# Altium project SATA.PrjPcb
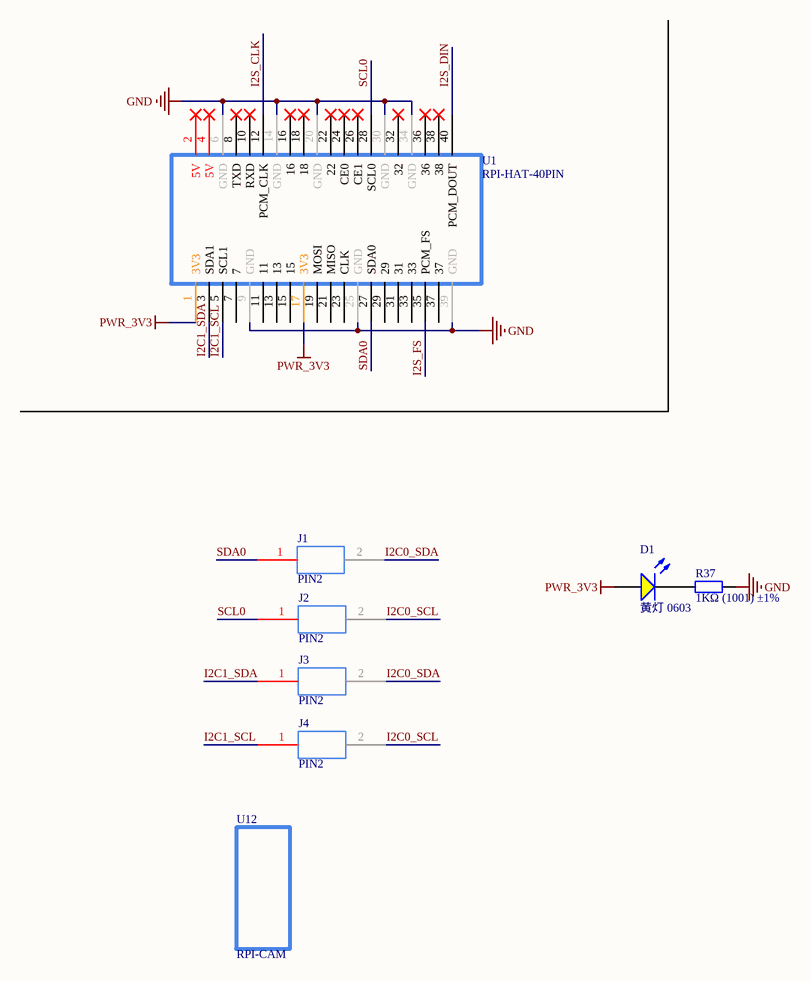
[diagram p0: S1_Interface.SchDoc]
2 sheets, 77 parts. Net scope: global (net labels, ports and power ports of the same name join across sheets).
Board file: S1.PcbDoc
Sheets:
  S1_Interface.SchDoc
  S2_Sensors.SchDoc

## Sheet S1_Interface.SchDoc
size A3; SheetNumber: 1; SheetTotal: 2

### Parts
D1  黄灯 0603  [0603_LED_S1]
J1  PIN2  [PIN2]
J2  PIN2  [PIN2]
J3  PIN2  [PIN2]
J4  PIN2  [PIN2]
R37  1KΩ (1001) ±1%  [0603_R]
U1  RPI-HAT-40PIN  [RPI-HAT-40PIN]
U12  RPI-CAM  [RPI-CAM]

### Nets
GND: R37.2 U1.6(GND) U1.9(GND) U1.14(GND) U1.20(GND) U1.25(GND) U1.30(GND) U1.34(GND) U1.39(GND)
PWR_3V3: D1.A U1.1(3V3) U1.17(3V3)
I2C0_SCL: J2.2(GND) J4.2(GND)
I2C0_SDA: J1.2(GND) J3.2(GND)
I2C1_SCL: J4.1(VCC) U1.5(SCL1)
I2C1_SDA: J3.1(VCC) U1.3(SDA1)
I2S_CLK: U1.12(PCM_CLK)
I2S_DIN: U1.40(PCM_DOUT)
I2S_FS: U1.35(PCM_FS)
SCL0: J2.1(VCC) U1.28(SCL0)
SDA0: J1.1(VCC) U1.27(SDA0)
NetD1_K: D1.K R37.1

Not connected (* = marked no-connect by the designer): U1 2(5V)* 4(5V)* 7 8(TXD)* 10(RXD)* 11 13 15 16* 18* 19(MOSI) 21(MISO) 22* 23(CLK) 24(CE0)* 26(CE1)* 29 31 32* 33 36* 37 38*

### Library data of the parts
D1 = 0603 黄灯: 发光二极管; ComponentLink1Description: 供应商链接; ComponentLink1URL: http://www.szlcsc.com/product/details_73147.html; Package: 0603; Supplier: LC; SuppliersPartNumber: C72038
R37 = 0603 1KΩ (1001) 1%: 贴片电阻; ComponentLink1Description: 供应商链接; ComponentLink1URL: http://www.szlcsc.com/product/details_21904.html; Package: 0603; Supplier: LC; SuppliersPartNumber: C21190

## Sheet S2_Sensors.SchDoc
size A3; SheetNumber: 2; SheetTotal: 2
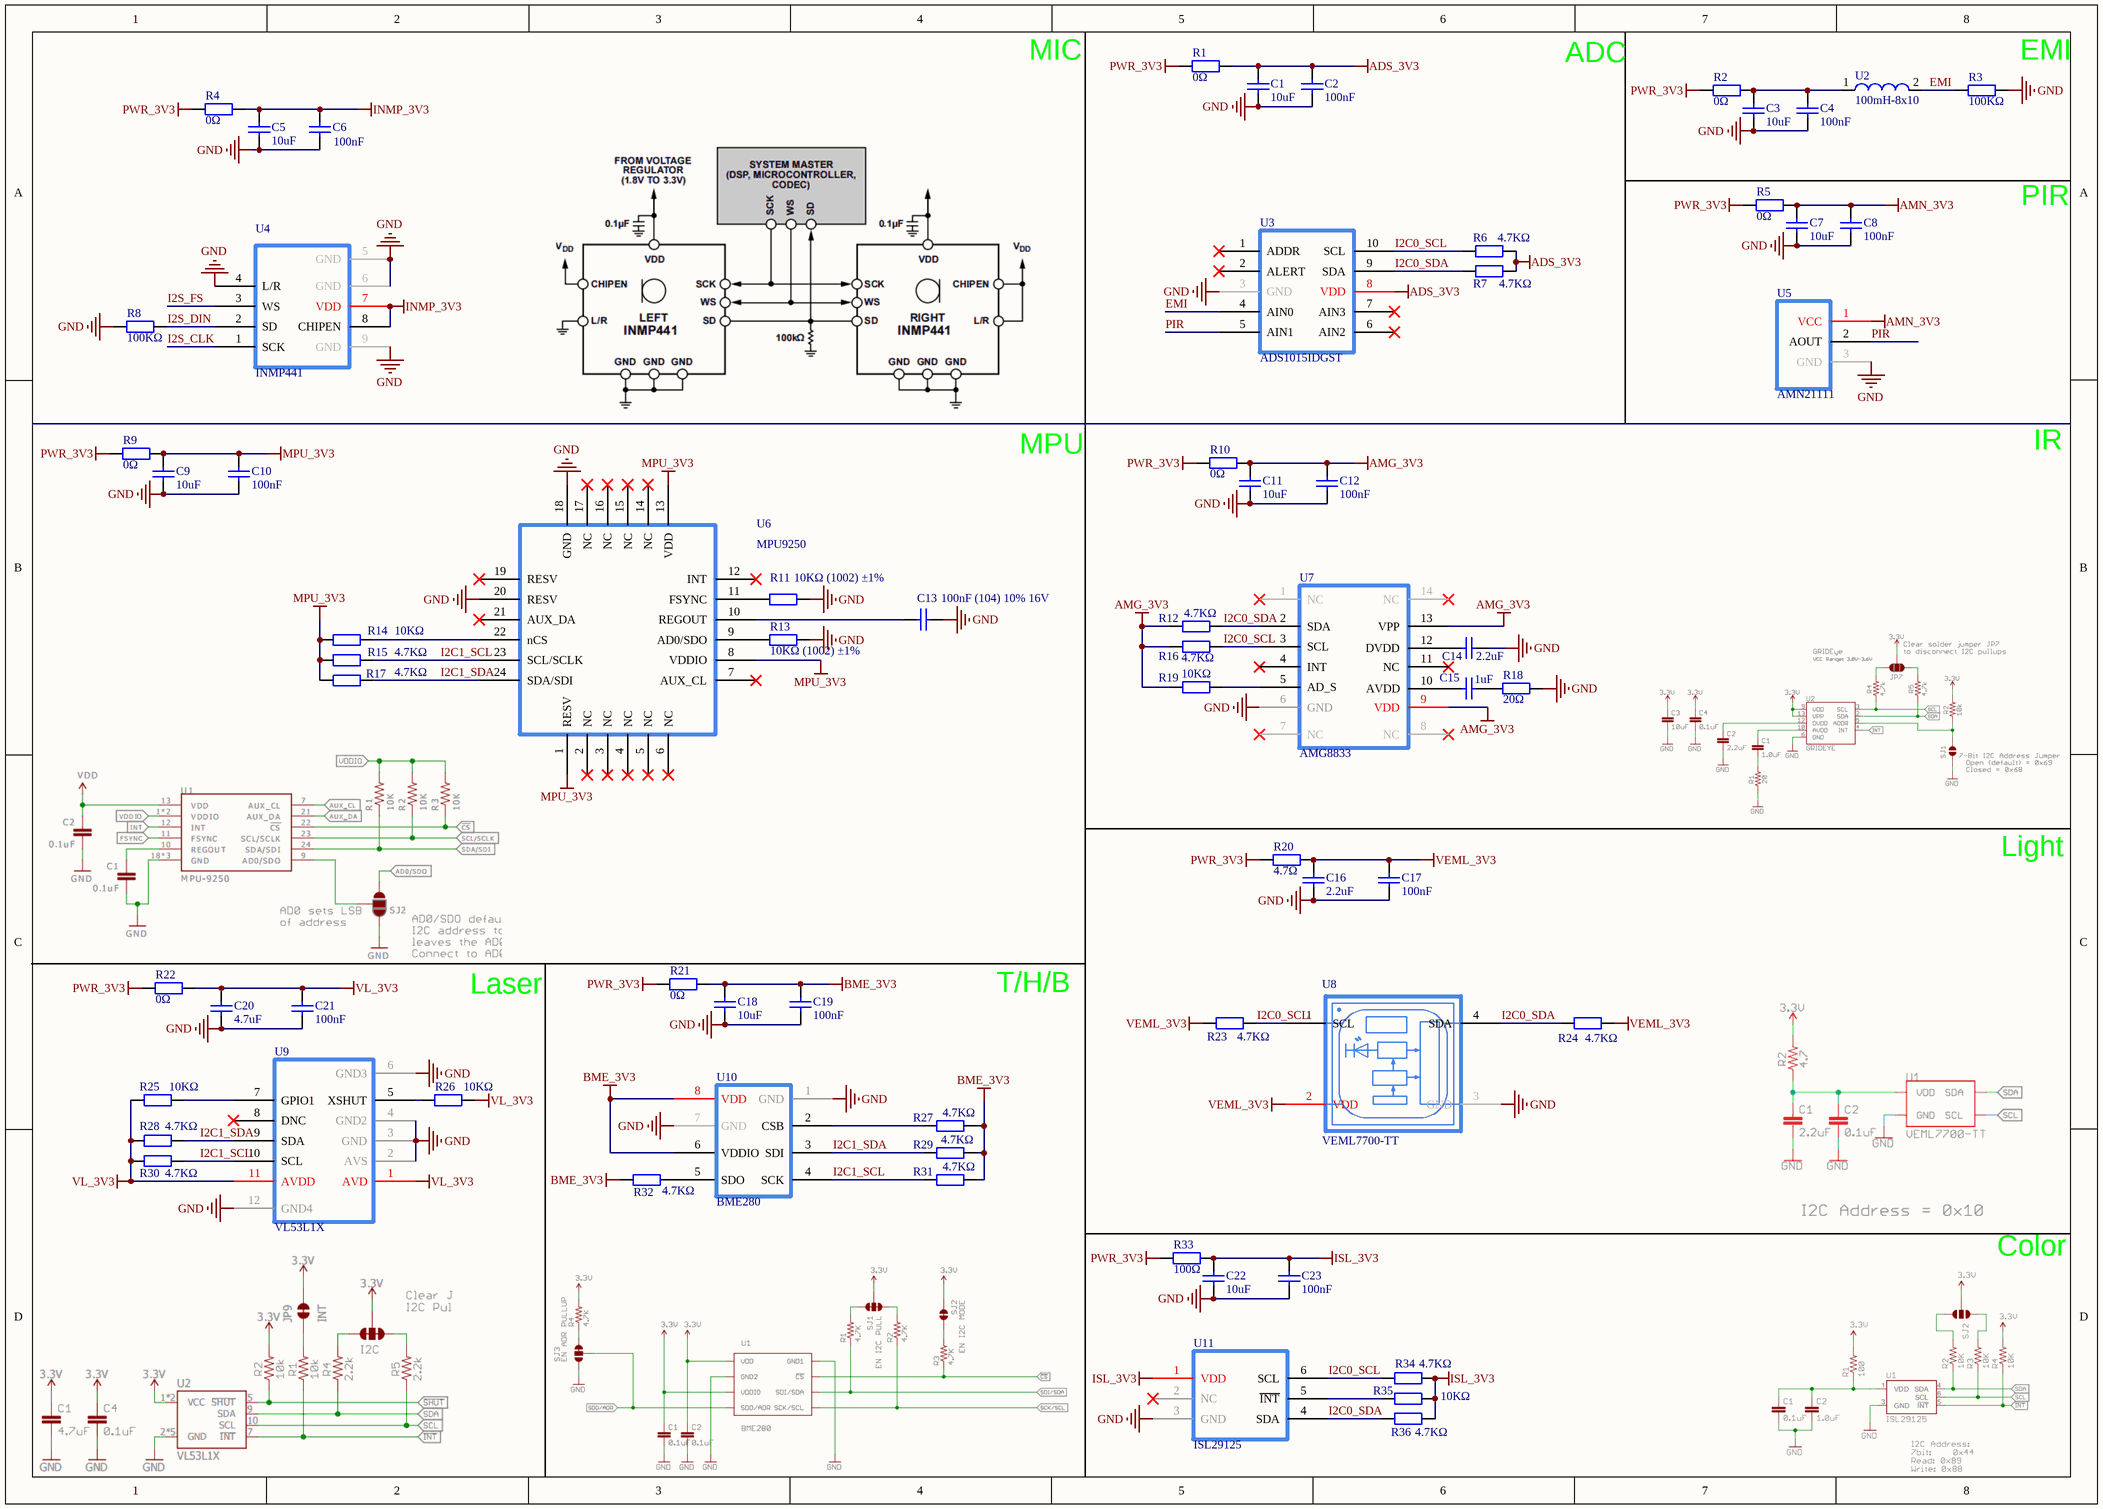
[diagram p1: S2_Sensors.SchDoc]

### Parts
C1  10uF  [0402_C]
C2  100nF  [0402_C]
C3  10uF  [0402_C]
C4  100nF  [0402_C]
C5  10uF  [0402_C]
C6  100nF  [0402_C]
C7  10uF  [0402_C]
C8  100nF  [0402_C]
C9  10uF  [0402_C]
C10  100nF  [0402_C]
C11  10uF  [0402_C]
C12  100nF  [0402_C]
C13  100nF (104) 10% 16V  [0402_C]
C14  2.2uF  [0603_C]
C15  1uF  [0603_C]
C16  2.2uF  [0402_C]
C17  100nF  [0402_C]
C18  10uF  [0402_C]
C19  100nF  [0402_C]
C20  4.7uF  [0402_C]
C21  100nF  [0402_C]
C22  10uF  [0402_C]
C23  100nF  [0402_C]
R1  0Ω  [0402_R]
R2  0Ω  [0402_R]
R3  100KΩ  [0402_R]
R4  0Ω  [0402_R]
R5  0Ω  [0402_R]
R6  4.7KΩ  [0402_R]
R7  4.7KΩ  [0402_R]
R8  100KΩ  [0402_R]
R9  0Ω  [0402_R]
R10  0Ω  [0402_R]
R11  10KΩ (1002) ±1%  [0402_R]
R12  4.7KΩ  [0402_R]
R13  10KΩ (1002) ±1%  [0402_R]
R14  10KΩ  [0402_R]
R15  4.7KΩ  [0402_R]
R16  4.7KΩ  [0402_R]
R17  4.7KΩ  [0402_R]
R18  20Ω  [0603_R]
R19  10KΩ  [0402_R]
R20  4.7Ω  [0402_R]
R21  0Ω  [0402_R]
R22  0Ω  [0402_R]
R23  4.7KΩ  [0402_R]
R24  4.7KΩ  [0402_R]
R25  10KΩ  [0402_R]
R26  10KΩ  [0402_R]
R27  4.7KΩ  [0402_R]
R28  4.7KΩ  [0402_R]
R29  4.7KΩ  [0402_R]
R30  4.7KΩ  [0402_R]
R31  4.7KΩ  [0402_R]
R32  4.7KΩ  [0402_R]
R33  100Ω  [0402_R]
R34  4.7KΩ  [0402_R]
R35  10KΩ  [0402_R]
R36  4.7KΩ  [0402_R]
U2  100mH-8x10  [100mH-8x10]
U3  ADS1015IDGST  [ADS1015]
U4  INMP441  [INMP441]
U5  AMN21111  [AMN21111]
U6  MPU9250  [MPU9250]
U7  AMG8833  [AMG8833]
U8  VEML7700-TT  [VEML7700-TT]
U9  VL53L1X  [VL53L1X]
U10  BME280  [BME280]
U11  ISL29125  [ISL29125]

### Nets
ADS_3V3: C1.2 C2.2 R1.2 R6.2 R7.2 U3.8(VDD)
AMG_3V3: C11.1 C12.1 R10.2 R12.1 R16.1 R19.1 U7.9(VDD) U7.13(VPP)
AMN_3V3: C7.2 C8.2 R5.2 U5.1(VCC)
BME_3V3: C18.1 C19.1 R21.2 R27.2 R29.2 R31.2 R32.1 U10.6(VDDIO) U10.8(VDD)
GND: C1.1 C2.1 C3.1 C4.1 C5.1 C6.1 C7.1 C8.1 C9.2 C10.2 C11.2 C12.2 C13.2 C14.2 C16.2 C17.2 C18.2 C19.2 C20.1 C21.1 C22.2 C23.2 R3.2 R8.2 R11.2 R13.2 R18.2 U3.3(GND) U4.4(L/R) U4.5(GND) U4.6(GND) U4.9(GND) U5.3(GND) U6.18(GND) U6.20(RESV) U7.6(GND) U8.3(GND) U9.2(AVS) U9.3(GND) U9.4(GND2) U9.6(GND3) U9.12(GND4) U10.1(GND) U10.7(GND) U11.3(GND)
INMP_3V3: C5.2 C6.2 R4.2 U4.7(VDD) U4.8(CHIPEN)
ISL_3V3: C22.1 C23.1 R33.2 R34.2 R35.2 R36.2 U11.1(VDD)
MPU_3V3: C9.1 C10.1 R9.2 R14.1 R15.1 R17.1 U6.1(RESV) U6.8(VDDIO) U6.13(VDD)
PWR_3V3: R1.1 R2.1 R4.1 R5.1 R9.1 R10.1 R20.1 R21.1 R22.1 R33.1
VEML_3V3: C16.1 C17.1 R20.2 R23.1 R24.2 U8.2(VDD)
VL_3V3: C20.2 C21.2 R22.2 R25.1 R26.2 R28.1 R30.1 U9.1(AVD) U9.11(AVDD)
EMI: R3.1 U2.2 U3.4(AIN0)
I2C0_SCL: R6.1 R16.2 R23.2 R34.1 U3.10(SCL) U7.3(SCL) U8.1(SCL) U11.6(SCL)
I2C0_SDA: R7.1 R12.2 R24.1 R36.1 U3.9(SDA) U7.2(SDA) U8.4(SDA) U11.4(SDA)
I2C1_SCL: R15.2 R30.2 R31.1 U6.23(SCL/SCLK) U9.10(SCL) U10.4(SCK)
I2C1_SDA: R17.2 R28.2 R29.1 U6.24(SDA/SDI) U9.9(SDA) U10.3(SDI)
I2S_CLK: U4.1(SCK)
I2S_DIN: R8.1 U4.2(SD)
I2S_FS: U4.3(WS)
PIR: U3.5(AIN1) U5.2(AOUT)
NetC3_2: C3.2 C4.2 R2.2 U2.1
NetC13_1: C13.1 U6.10(REGOUT)
NetC14_1: C14.1 U7.12(DVDD)
NetC15_1: C15.1 U7.10(AVDD)
NetC15_2: C15.2 R18.1
NetR11_1: R11.1 U6.11(FSYNC)
NetR13_1: R13.1 U6.9(AD0/SDO)
NetR14_2: R14.2 U6.22(nCS)
NetR19_2: R19.2 U7.5(AD_S)
NetR25_2: R25.2 U9.7(GPIO1)
NetR26_1: R26.1 U9.5(XSHUT)
NetR27_1: R27.1 U10.2(CSB)
NetR32_2: R32.2 U10.5(SDO)
NetR35_1: R35.1 U11.5(~{INT})

Not connected (* = marked no-connect by the designer): U3 1(ADDR)* 2(ALERT)* 6(AIN2)* 7(AIN3)*; U6 2(NC)* 3(NC)* 4(NC)* 5(NC)* 6(NC)* 7(AUX_CL)* 12(INT)* 14(NC)* 15(NC)* 16(NC)* 17(NC)* 19(RESV)* 21(AUX_DA)*; U7 1(NC)* 4(INT)* 7(NC)* 8(NC)* 11(NC)* 14(NC)*; U9 8(DNC)*; U11 2(NC)*

### Notes on the sheet
- MIC
- ADC
- (near R3) EMI
- PIR
- IR
- MPU
- Light
- Laser
- T/H/B
- Color

### Library data of the parts
C1 C3 C5 C7 C9 C11 C16 C18 C22 = 0402 10uF (106) 20% 6.3V: 贴片电容; ComponentLink1Description: 供应商链接; ComponentLink1URL: http://www.szlcsc.com/product/details_16204.html; Package: 0402; Supplier: LC; SuppliersPartNumber: C15525
C2 C4 C6 C8 C10 C12 C13 C17 C19 C21 C23 = 0402 100nF (104) 10% 16V: 贴片电容; ComponentLink1Description: 供应商链接; ComponentLink1URL: http://www.szlcsc.com/product/details_1877.html; Package: 0402; Supplier: LC; SuppliersPartNumber: C1525
C14 = 0603 2.2uF (225) 10% 16V: 贴片电容; ComponentLink1Description: 供应商链接; ComponentLink1URL: http://www.szlcsc.com/product/details_24366.html; Package: 0603; Supplier: LC; SuppliersPartNumber: C23630
C15 = 0603 1uF (105) 10% 50V: 贴片电容; ComponentLink1Description: 供应商链接; ComponentLink1URL: http://www.szlcsc.com/product/details_16531.html; Package: 0603; Supplier: LC; SuppliersPartNumber: C15849
C20 = 0402 4.7uF (475) 20% 10V: 贴片电容; ComponentLink1Description: 供应商链接; ComponentLink1URL: http://www.szlcsc.com/product/details_24469.html; Package: 0402; Supplier: LC; SuppliersPartNumber: C23733
R1 R2 R4 R5 R9 R10 R21 R22 = 0402 0Ω (0R0) 1%: 贴片电阻; ComponentLink1Description: 供应商链接; ComponentLink1URL: http://www.szlcsc.com/product/details_17853.html; Package: 0402; Supplier: LC; SuppliersPartNumber: C17168
R3 R8 = 0402 100KΩ (1003) 1%: 贴片电阻; ComponentLink1Description: 供应商链接; ComponentLink1URL: http://www.szlcsc.com/product/details_26484.html; Package: 0402; Supplier: LC; SuppliersPartNumber: C25741
R6 R7 R12 R15-R17 R23 R24 R27-R32 R34 R36 = 0402 4.7KΩ (4701) 1%: 贴片电阻; ComponentLink1Description: 供应商链接; ComponentLink1URL: http://www.szlcsc.com/product/details_26643.html; Package: 0402; Supplier: LC; SuppliersPartNumber: C25900
R11 R13 R14 R19 R25 R26 R35 = 0402 10KΩ (1002) 1%: 贴片电阻; ComponentLink1Description: 供应商链接; ComponentLink1URL: http://www.szlcsc.com/product/details_26487.html; Package: 0402; Supplier: LC; SuppliersPartNumber: C25744
R18 = 0603 22Ω (22R0) 1%: 贴片电阻; ComponentLink1Description: 供应商链接; ComponentLink1URL: http://www.szlcsc.com/product/details_24078.html; Package: 0603; Supplier: LC; SuppliersPartNumber: C23345
R20 = 0402 10Ω (10R0) 1%: 贴片电阻; ComponentLink1Description: 供应商链接; ComponentLink1URL: http://www.szlcsc.com/product/details_25820.html; Package: 0402; Supplier: LC; SuppliersPartNumber: C25077
R33 = 0402 100Ω (1000) 1%: 贴片电阻; ComponentLink1Description: 供应商链接; ComponentLink1URL: http://www.szlcsc.com/product/details_25819.html; Package: 0402; Supplier: LC; SuppliersPartNumber: C25076
U2 = 100mH-8x10: Sensor 100mH
U3 = ADS1015IDGST: ADC 12Bit 4Channel; MF: Texas Instruments; Mouser-Purchase-URL: https://snapeda.com/shop?store=Mouser&id=425936; Price: None; Availability: Good; Package: VSSOP-10 Texas Instruments; DigiKey-Purchase-URL: https://snapeda.com/shop?store=DigiKey&id=425936; MP: ADS1015IDGST; Value: *; SnapEDA_Link: https://www.snapeda.com/parts/ADS1015IDGST/Texas%20Instruments/view-part/425936/?ref=snap; Texas_Instruments-Purchase-URL: https://snapeda.com/shop?store=Texas+Instruments&id=425936
U4 = INMP441: Sensor Microphone
U5 = AMN21111: Sensor PIR
U6 = MPU9250: Sensor MPU
U7 = AMG8833: Sensor IR
U8 = VEML7700-TT: Sensor Light; MF: Vishay Semiconductor; Package: SMD-4 Vishay Semiconductor; Availability: Unavailable; Value: *; MP: VEML7700-TT; SnapEDA_Link: https://www.snapeda.com/parts/VEML7700-TT/Vishay%20Semiconductor%20Opto%20Division/view-part/534245/?ref=snap; Price: None
U9 = VL53L1X: Sensor Laser
U10 = BME280: Sensor T/H/B TOP View
U11 = ISL29125: Sensor Color

## Nets that join several sheets
GND: S1_Interface (9 pins), S2_Sensors (45 pins)
PWR_3V3: S1_Interface (D1.A U1.1 U1.17), S2_Sensors (10 pins)
I2C0_SCL: S1_Interface (J2.2 J4.2), S2_Sensors (8 pins)
I2C0_SDA: S1_Interface (J1.2 J3.2), S2_Sensors (8 pins)
I2C1_SCL: S1_Interface (J4.1 U1.5), S2_Sensors (6 pins)
I2C1_SDA: S1_Interface (J3.1 U1.3), S2_Sensors (6 pins)
I2S_CLK: S1_Interface (U1.12), S2_Sensors (U4.1)
I2S_DIN: S1_Interface (U1.40), S2_Sensors (R8.1 U4.2)
I2S_FS: S1_Interface (U1.35), S2_Sensors (U4.3)